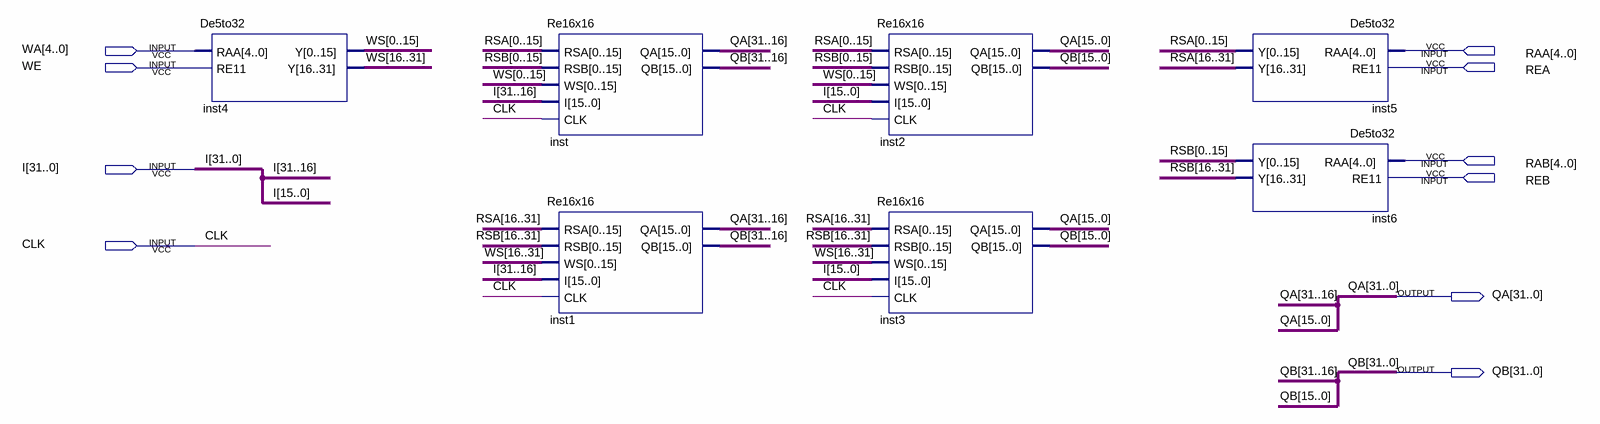
[diagram p0: schematic sheet]
// Quartus schematic Register32x32.bdf as structural Verilog: 7 symbols, 10 pins
module Register32x32 (
  input  [4:0] WA,
  input  [4:0] RAA,
  input  WE,
  input  REA,
  input  [4:0] RAB,
  input  [31:0] I,
  input  REB,
  input  CLK,
  output [31:0] QA,
  output [31:0] QB
);

  wire [31:0] RSA, RSB, WS;

  De5to32 inst4 (.RAA(WA), .RE11(WE), .Y(WS));
  Re16x16 inst (
    .RSA({RSA[0], RSA[1], RSA[2], RSA[3], RSA[4], RSA[5], RSA[6], RSA[7], RSA[8], RSA[9], RSA[10], RSA[11], RSA[12], RSA[13], RSA[14], RSA[15]}),
    .RSB({RSB[0], RSB[1], RSB[2], RSB[3], RSB[4], RSB[5], RSB[6], RSB[7], RSB[8], RSB[9], RSB[10], RSB[11], RSB[12], RSB[13], RSB[14], RSB[15]}),
    .WS({WS[0], WS[1], WS[2], WS[3], WS[4], WS[5], WS[6], WS[7], WS[8], WS[9], WS[10], WS[11], WS[12], WS[13], WS[14], WS[15]}),
    .I(I[31:16]), .CLK(CLK), .QA(QA[31:16]), .QB(QB[31:16]));
  Re16x16 inst1 (
    .RSA({RSA[16], RSA[17], RSA[18], RSA[19], RSA[20], RSA[21], RSA[22], RSA[23], RSA[24], RSA[25], RSA[26], RSA[27], RSA[28], RSA[29], RSA[30], RSA[31]}),
    .RSB({RSB[16], RSB[17], RSB[18], RSB[19], RSB[20], RSB[21], RSB[22], RSB[23], RSB[24], RSB[25], RSB[26], RSB[27], RSB[28], RSB[29], RSB[30], RSB[31]}),
    .WS({WS[16], WS[17], WS[18], WS[19], WS[20], WS[21], WS[22], WS[23], WS[24], WS[25], WS[26], WS[27], WS[28], WS[29], WS[30], WS[31]}),
    .I(I[31:16]), .CLK(CLK), .QA(QA[31:16]), .QB(QB[31:16]));
  Re16x16 inst2 (
    .RSA({RSA[0], RSA[1], RSA[2], RSA[3], RSA[4], RSA[5], RSA[6], RSA[7], RSA[8], RSA[9], RSA[10], RSA[11], RSA[12], RSA[13], RSA[14], RSA[15]}),
    .RSB({RSB[0], RSB[1], RSB[2], RSB[3], RSB[4], RSB[5], RSB[6], RSB[7], RSB[8], RSB[9], RSB[10], RSB[11], RSB[12], RSB[13], RSB[14], RSB[15]}),
    .WS({WS[0], WS[1], WS[2], WS[3], WS[4], WS[5], WS[6], WS[7], WS[8], WS[9], WS[10], WS[11], WS[12], WS[13], WS[14], WS[15]}),
    .I(I[15:0]), .CLK(CLK), .QA(QA[15:0]), .QB(QB[15:0]));
  Re16x16 inst3 (
    .RSA({RSA[16], RSA[17], RSA[18], RSA[19], RSA[20], RSA[21], RSA[22], RSA[23], RSA[24], RSA[25], RSA[26], RSA[27], RSA[28], RSA[29], RSA[30], RSA[31]}),
    .RSB({RSB[16], RSB[17], RSB[18], RSB[19], RSB[20], RSB[21], RSB[22], RSB[23], RSB[24], RSB[25], RSB[26], RSB[27], RSB[28], RSB[29], RSB[30], RSB[31]}),
    .WS({WS[16], WS[17], WS[18], WS[19], WS[20], WS[21], WS[22], WS[23], WS[24], WS[25], WS[26], WS[27], WS[28], WS[29], WS[30], WS[31]}),
    .I(I[15:0]), .CLK(CLK), .QA(QA[15:0]), .QB(QB[15:0]));
  De5to32 inst5 (.RAA(RAA), .RE11(REA), .Y(RSA));
  De5to32 inst6 (.RAA(RAB), .RE11(REB), .Y(RSB));
endmodule
